# Altium schematic sheet Power_Nichrome.SchDoc
size A; SheetNumber: 3; SheetTotal: 3; SPICEModelCacheTJWSCOIJ: <root> / <DocumentId>TJWSCOIJ</DocumentId> / </root>
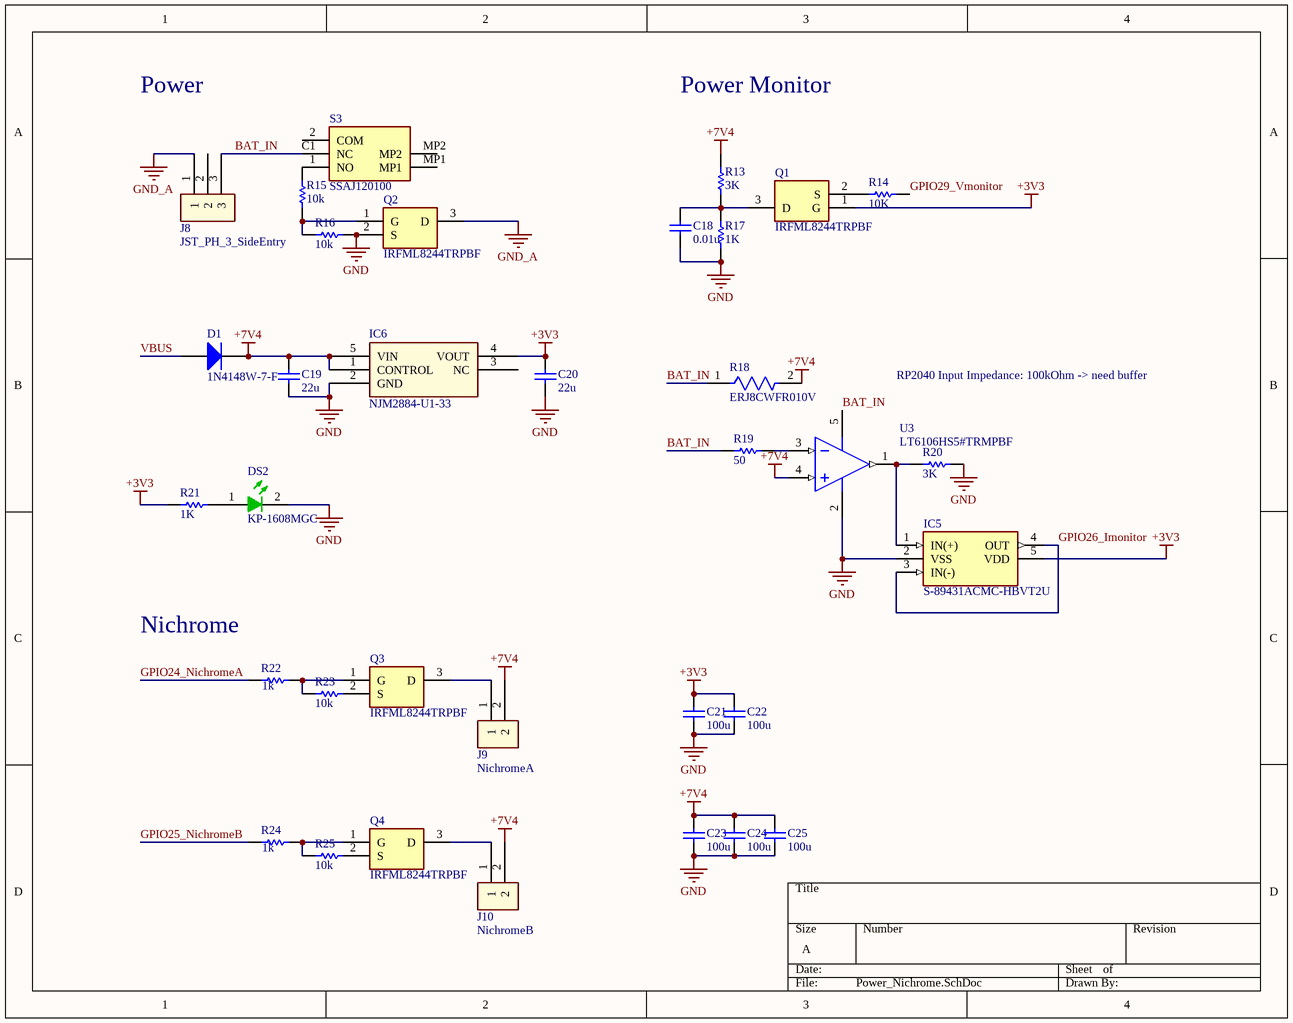
[diagram p0: Power_Nichrome.SchDoc]

## Parts
C18  value 0.01u  [1608[0603]]  (hidden comment: Capacitor)
C19  value 22u  [1608[0603]]  (hidden comment: Capacitor)
C20  value 22u  [1608[0603]]  (hidden comment: Capacitor)
C21  value 100u  [1608[0603]]  (hidden comment: Capacitor)
C22  value 100u  [1608[0603]]  (hidden comment: Capacitor)
C23  value 100u  [1608[0603]]  (hidden comment: Capacitor)
C24  value 100u  [1608[0603]]  (hidden comment: Capacitor)
C25  value 100u  [1608[0603]]  (hidden comment: Capacitor)
D1  1N4148W-7-F  [DIOD-SOD123-2_V]
DS2  KP-1608MGC  [KING-0603LED_GREEN_V]
IC5  S-89431ACMC-HBVT2U  [SOT95P275X130-5N]
IC6  NJM2884-U1-33  [NJM2884-U1-33]
J8  JST_PH_3_SideEntry  [JST_PH_3_SideEntry]
J9  NichromeA  [PinHeader_2.0_2_SMD]
J10  NichromeB  [PinHeader_2.0_2_SMD]
Q1  IRFML8244TRPBF  [SOT95P237X112-3N]
Q2  IRFML8244TRPBF  [SOT95P237X112-3N]
Q3  IRFML8244TRPBF  [SOT95P237X112-3N]
Q4  IRFML8244TRPBF  [SOT95P237X112-3N]
R13  value 3K  [1608[0603]]  (hidden comment: Resistor)
R14  value 10K  [1608[0603]]  (hidden comment: Resistor)
R15  value 10k  [1608[0603]]  (hidden comment: Resistor)
R16  value 10k  [1608[0603]]  (hidden comment: Resistor)
R17  value 1K  [1608[0603]]  (hidden comment: Resistor)
R18  ERJ8CWFR010V  [FP-ERJ8CW-MFG]
R19  value 50  [1608[0603]]  (hidden comment: Resistor)
R20  value 3K  [1608[0603]]  (hidden comment: Resistor)
R21  value 1K  [1608[0603]]  (hidden comment: Resistor)
R22  value 1k  [1608[0603]]  (hidden comment: Resistor)
R23  value 10k  [1608[0603]]  (hidden comment: Resistor)
R24  value 1k  [1608[0603]]  (hidden comment: Resistor)
R25  value 10k  [1608[0603]]  (hidden comment: Resistor)
S3  SSAJ120100  [SSAJ120100]
U3  LT6106HS5#TRMPBF  [LT-S5-5-TSOT-23_N]

## Nets
+3V3: C20.2 C21.2 C22.2 IC5.5(VDD) IC6.4(VOUT) Q1.1(G) R21.1
+7V4: C19.2 C23.2 C24.2 C25.2 D1.2(K) IC6.1(CONTROL) IC6.5(VIN) J9.2 J10.2 R13.2 R18.2 U3.4(+IN)
GND: C18.2 C19.1 C20.1 C21.1 C22.1 C23.1 C24.1 C25.1 DS2.2(K) IC5.2(VSS) IC6.2(GND) Q2.2(S) R16.1 R17.1 R20.2 U3.2(V-)
GND_A: J8.1 Q2.3(D)
BAT_IN: J8.3 R18.1 R19.1 S3.C1(NC) U3.5(V+)
GPIO24_NichromeA: R22.1
GPIO25_NichromeB: R24.1
GPIO26_Imonitor: IC5.3(IN(-)) IC5.4(OUT)
GPIO29_Vmonitor: R14.2
VBUS: D1.1(A)
NetC18_1: C18.1 Q1.3(D) R13.1 R17.2
NetDS2_1: DS2.1(A) R21.2
NetIC5_1: IC5.1(IN(+)) R20.1 U3.1(OUT)
NetJ9_1: J9.1 Q3.3(D)
NetJ10_1: J10.1 Q4.3(D)
NetQ1_2: Q1.2(S) R14.1
NetQ2_1: Q2.1(G) R15.2 R16.2
NetQ3_1: Q3.1(G) R22.2 R23.1
NetQ4_1: Q4.1(G) R24.2 R25.1
NetR15_1: R15.1 S3.1(NO)
NetR19_2: R19.2 U3.3(-IN)

Not connected (* = marked no-connect by the designer): IC6 3(NC); J8 2; Q3 2(S); Q4 2(S); R23 2; R25 2; S3 2(COM) MP1 MP2

## Notes on the sheet
- Power
- Power Monitor
- RP2040 Input Impedance: 100kOhm -> need buffer
- (near R22) Nichrome

## Library data of the parts
C18-C25 = Capacitor: SimulationGenericComponent: True
D1 = CMP-2000-04932-2: Fast Switching Diode, 100 V, 0.15 A, -65 to 150 degC, 2-Pin?SOD123, RoHS, Tape and Reel; Recovery Time: 4ns; Brand: DiodesIncorporated; Unit Weight: 0.000353oz; Max Surge Current: 2A; Peak Reverse Voltage: 100V; Ir - Reverse Current: 1uA; Vf - Forward Voltage: 1.25V; Configuration: Single; If - Forward Current: 0.15A; Product Category: Diodes-GeneralPurpose,Power,Switching; Operating Temperature Range: -65Cto+150C; Packaging: Reel; Manufacturer URL: http://www.diodes.com/; Maximum Operating Temperature: +150C; Height: 1.25mm; Minimum Operating Temperature: -65C; Product: SwitchingDiodes; Package URL: http://www.diodes.com/datasheets/ds18004.pdf; Type: SwitchingDiode; Package Reference: SOD123-2; Width: 1.7mm; Datasheet URL: http://www.farnell.com/datasheets/1915529.pdf; Datasheet Version: Rev. 24-2, 10/2013; Series: 1N4148; Factory Pack Quantity: 3000; Length: 2.85mm; RoHS: True; Manufacturer: DiodesIncorporated; Mounting Style: SMD/SMT; Package / Case: SOD-123
DS2 = CMP-0404-00001-1: LED, SMT, 0603(1608), 1.1mm thickness, Green; Manufacturer: Kingbright; Reverse Voltage: 5 V; Power Dissipation: 75 mW; Forward Current: 30 mA; Packing Type: 2000 pcs / reel; Mounting Technology: Surface Mount; Storage Temperature: -40 to +85 degC; ComponentLink1URL: http://www.kingbright.com/; PackageDescription: 2-Pin SMT LED, 1.6 x 0.8 mm Pitch; PartNumber: KP-1608MGC; PackageReference: 0603LED_GREEN; ComponentLink1Description: Manufacturer URL
IC5 = S-89431ACMC-HBVT2U: Integrated Circuit; Manufacturer_Name: ABLIC Inc.; Datasheet Link: https://datasheet.datasheetarchive.com/originals/distributors/DKDS-7/134209.pdf; Height: 1.3mm; Manufacturer_Part_Number: S-89431ACMC-HBVT2U; Mouser Part Number: 628-S89431ACMCHBVT2G; Mouser Price/Stock: https://www.mouser.co.uk/ProductDetail/ABLIC/S-89431ACMC-HBVT2U/?qs=sE1HjTVAc2jFUPQ1oZ8CUg%3D%3D
J9 J10 = PinHeader_2.0_2_SMD
Q1-Q4 = IRFML8244TRPBF: Transistor; Manufacturer_Name: Infineon; Datasheet Link: http://www.infineon.com/dgdl/irfml8244pbf.pdf?fileId=5546d462533600a40153562817c91fc0; Height: 1.12mm; Manufacturer_Part_Number: IRFML8244TRPBF; Mouser Part Number: 942-IRFML8244TRPBF; Mouser Price/Stock: https://www.mouser.co.uk/ProductDetail/Infineon-IR/IRFML8244TRPBF?qs=9%252BKlkBgLFf0%252B01xOpCf7sA%3D%3D; Arrow Part Number: IRFML8244TRPBF; Arrow Price/Stock: https://www.arrow.com/en/products/irfml8244trpbf/infineon-technologies-ag
R13-R17 R19-R25 = Resistor: TC1: 0; SimulationGenericComponent: True; TC2: 0
R18 = CMP-2003-00786-2: RES 0.01 OHM 1% 1W 1206; Temperature Coefficient: 75ppm/°C; Resistance: 10mR; Military Standard: Not; Depth: 1.6mm; Mount: Surface Mount; Resistor Type: Thick Film; Termination: Flat; Features: Automotive AEC-Q200; Number of Terminations: 2; Max Power Dissipation: 1W; Tolerance: 1%; Case Code (Imperial): 1206; Max Operating Temperature: 125°C; Case Code (Metric): 3216; Lead Free: Lead Free; Case/Package: 1206; Power Rating: 1W; Width: 0.063inch; Packaging: Cut Tape; Length: 3.2mm; Height: 0.03inch; REACH SVHC: No SVHC; Min Operating Temperature: -55°C
S3 = SSAJ120100: Switch; Manufacturer_Name: ALPS Electric; Datasheet Link: https://www.mouser.jp/datasheet/2/15/SSAJ-1370983.pdf; Height: 0.7mm; Manufacturer_Part_Number: SSAJ120100; Mouser Part Number: 688-SSAJ120100; Mouser Price/Stock: https://www.mouser.co.uk/ProductDetail/Alps-Alpine/SSAJ120100?qs=35GPJvxY%252Bl5mRNwFoBrl2g%3D%3D
U3 = CMP-0359-01868-2: Single Channel, Low Cost, High Side Current Sense Operational Amplifier, 0.2 MHz Typical GBW, 5-Pin SOT-23 (S5-5), High Temperature / Automotive, Pb-Free, Mini Reel; Manufacturer: Linear Technology; Linear Technology Part Number: LT6106; Is (mA) Typical: 0.06; Vs Min (V): 2.7; Vos (mV) Typical: 0.15; Vs Max (V): 36; Vos (mV) Guaranteed: 0.25; GBW (MHz) Typical: 0.2; Channels (#): 1; Packing: Mini Reel; Code_JEDEC: MO-193; Type: CSA; ComponentLink1Description: Manufacturer URL; ComponentLink3URL: http://cds.linear.com/docs/en/packaging/SOT_5_05-08-1635.pdf; ComponentLink3Description: Package Specification; PackageDescription: 5-Lead Plastic TSOT-23, Body 1.63 x 2.90 mm, Pitch 0.95 mm; DatasheetVersion: Rev. A; RevisionNote: URLs updated; PackageReference: LT-S5-5-TSOT-23; Mounting Technology: Surface Mount; RoHS: Pb-Free; ComponentLink2Description: Datasheet; PartNumber: LT6106HS5#TRMPBF; ComponentLink1URL: http://www.linear.com/; ComponentLink2URL: http://cds.linear.com/docs/en/datasheet/6106fa.pdf